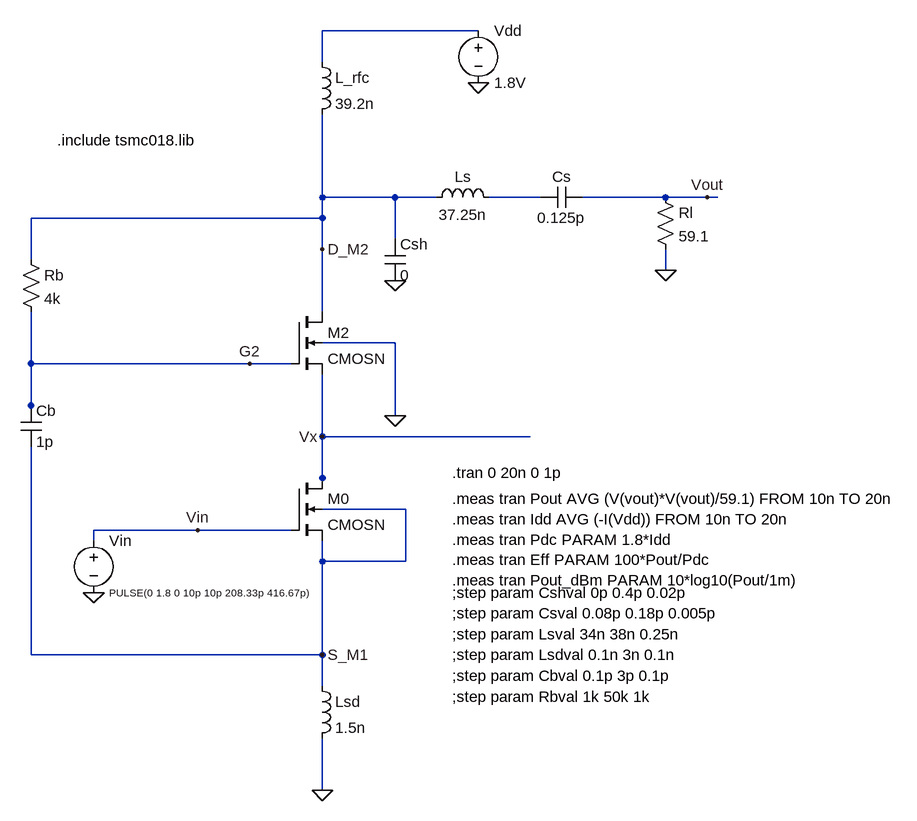
[diagram p0: schematic SELFBIASED PA.asc]
SELFBIASED PA.asc, the LTspice schematic file:
Version 4
SHEET 1 1916 916
WIRE 512 -272 272 -272
WIRE 272 -224 272 -272
WIRE 272 -16 272 -144
WIRE 384 -16 272 -16
WIRE 448 -16 384 -16
WIRE 608 -16 528 -16
WIRE 800 -16 672 -16
WIRE 864 -16 800 -16
WIRE 880 -16 864 -16
WIRE 272 16 272 -16
WIRE 272 16 -176 16
WIRE 384 48 384 -16
WIRE 272 64 272 16
WIRE -176 80 -176 16
WIRE 800 96 800 64
WIRE 272 160 272 64
WIRE 384 208 272 208
WIRE -176 240 -176 160
WIRE 160 240 -176 240
WIRE 224 240 160 240
WIRE -176 304 -176 240
WIRE -176 320 -176 304
WIRE 384 320 384 208
WIRE 272 352 272 256
WIRE 592 352 272 352
WIRE 272 416 272 352
WIRE 272 432 272 416
WIRE 400 464 272 464
WIRE 80 496 -80 496
WIRE 224 496 80 496
WIRE -80 512 -80 496
WIRE 272 544 272 512
WIRE 400 544 400 464
WIRE 400 544 272 544
WIRE -176 688 -176 368
WIRE 272 688 272 544
WIRE 272 688 -176 688
WIRE 272 736 272 688
WIRE 272 896 272 816
FLAG 512 -192 0
FLAG 800 96 0
FLAG 384 320 0
FLAG 272 896 0
FLAG -80 592 0
FLAG 80 496 Vin
FLAG 272 352 Vx
FLAG 864 -16 Vout
FLAG 384 112 0
FLAG 272 64 D_M2
FLAG 272 688 S_M1
FLAG 160 240 G2
SYMBOL cmosn 224 160 R0
SYMATTR InstName M2
SYMATTR Value2 l=0.18u w=25u m=15
SYMBOL cmosn 224 416 R0
SYMATTR InstName M0
SYMATTR Value2 l=0.18u w=25u m=15
SYMBOL voltage -80 496 R0
WINDOW 3 24 96 Left 1
WINDOW 123 0 0 Left 0
WINDOW 39 0 0 Left 0
SYMATTR Value PULSE(0 1.8 0 10p 10p 208.33p 416.67p)
SYMATTR InstName Vin
SYMBOL voltage 512 -288 R0
SYMATTR InstName Vdd
SYMATTR Value 1.8V
SYMBOL ind 256 -240 R0
SYMATTR InstName L_rfc
SYMATTR Value 39.2n
SYMBOL cap 672 -32 R90
WINDOW 0 0 32 VBottom 2
WINDOW 3 32 32 VTop 2
SYMATTR InstName Cs
SYMATTR Value 0.125p
SYMBOL res 784 -32 R0
SYMATTR InstName Rl
SYMATTR Value 59.1
SYMBOL ind 432 0 R270
WINDOW 0 32 56 VTop 2
WINDOW 3 5 56 VBottom 2
SYMATTR InstName Ls
SYMATTR Value 37.25n
SYMBOL cap 368 48 R0
SYMATTR InstName Csh
SYMATTR Value 0
SYMBOL cap -192 304 R0
SYMATTR InstName Cb
SYMATTR Value 1p
SYMBOL res -192 64 R0
SYMATTR InstName Rb
SYMATTR Value 4k
SYMBOL ind 256 720 R0
SYMATTR InstName Lsd
SYMATTR Value 1.5n
TEXT -136 -104 Left 2 !.include tsmc018.lib
TEXT 472 408 Left 2 !.tran 0 20n 0 1p
TEXT 472 448 Left 2 !.meas tran Pout AVG (V(vout)*V(vout)/59.1) FROM 10n TO 20n\n.meas tran Idd AVG (-I(Vdd)) FROM 10n TO 20n\n.meas tran Pdc PARAM 1.8*Idd\n.meas tran Eff PARAM 100*Pout/Pdc\n.meas tran Pout_dBm PARAM 10*log10(Pout/1m)
TEXT 472 592 Left 2 !;step param Cshval 0p 0.4p 0.02p
TEXT 472 656 Left 2 !;step param Lsval 34n 38n 0.25n
TEXT 472 624 Left 2 !;step param Csval 0.08p 0.18p 0.005p
TEXT 472 688 Left 2 !;step param Lsdval 0.1n 3n 0.1n
TEXT 472 752 Left 2 !;step param Rbval 1k 50k 1k
TEXT 472 720 Left 2 !;step param Cbval 0.1p 3p 0.1p

The netlist it stands for:
* SELFBIASED PA.asc
M2 D_M2 G2 Vx 0 CMOSN l=0.18u w=25u m=15
M0 Vx Vin S_M1 S_M1 CMOSN l=0.18u w=25u m=15
Vin Vin 0 PULSE(0 1.8 0 10p 10p 208.33p 416.67p)
Vdd N001 0 1.8V
L_rfc N001 D_M2 39.2n
Cs Vout N002 0.125p
Rl Vout 0 59.1
Ls D_M2 N002 37.25n
Csh D_M2 0 0
Cb G2 S_M1 1p
Rb D_M2 G2 4k
Lsd S_M1 0 1.5n
.model NMOS NMOS
.model PMOS PMOS
.lib standard.mos
.include tsmc018.lib
.tran 0 20n 0 1p
.meas tran Pout AVG (V(vout)*V(vout)/59.1) FROM 10n TO 20n
.meas tran Idd AVG (-I(Vdd)) FROM 10n TO 20n
.meas tran Pdc PARAM 1.8*Idd
.meas tran Eff PARAM 100*Pout/Pdc
.meas tran Pout_dBm PARAM 10*log10(Pout/1m)
;step param Cshval 0p 0.4p 0.02p
;step param Lsval 34n 38n 0.25n
;step param Csval 0.08p 0.18p 0.005p
;step param Lsdval 0.1n 3n 0.1n
;step param Rbval 1k 50k 1k
;step param Cbval 0.1p 3p 0.1p
.backanno
.end